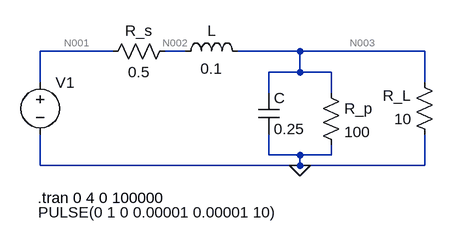
[diagram p0: schematic Draft1.asc]
Draft1.asc, the LTspice schematic file:
Version 4
SHEET 1 880 680
WIRE 0 112 -112 112
WIRE 112 112 80 112
WIRE 288 112 192 112
WIRE 480 112 288 112
WIRE 288 144 288 112
WIRE 288 144 240 144
WIRE 336 144 288 144
WIRE -112 160 -112 112
WIRE 480 160 480 112
WIRE 240 176 240 144
WIRE 336 176 336 144
WIRE 240 272 240 240
WIRE 288 272 240 272
WIRE 336 272 336 256
WIRE 336 272 288 272
WIRE -112 288 -112 240
WIRE 288 288 288 272
WIRE 288 288 -112 288
WIRE 480 288 480 240
WIRE 480 288 288 288
FLAG 288 288 0
SYMBOL res -16 128 R270
WINDOW 0 32 56 VTop 2
WINDOW 3 0 56 VBottom 2
SYMATTR InstName R_s
SYMATTR Value 0.5
SYMBOL ind 96 128 R270
WINDOW 0 32 56 VTop 2
WINDOW 3 5 56 VBottom 2
SYMATTR InstName L
SYMATTR Value 0.1
SYMBOL cap 224 176 R0
SYMATTR InstName C
SYMATTR Value 0.25
SYMBOL res 320 160 R0
SYMATTR InstName R_p
SYMATTR Value 100
SYMBOL res 496 256 R180
WINDOW 0 36 76 Left 2
WINDOW 3 36 40 Left 2
SYMATTR InstName R_L
SYMATTR Value 10
SYMBOL voltage -112 144 R0
WINDOW 3 -3 216 Left 2
WINDOW 123 0 0 Left 0
WINDOW 39 0 0 Left 0
SYMATTR InstName V1
SYMATTR Value PULSE(0 1 0 0.00001 0.00001 10)
TEXT -116 338 Left 2 !.tran 0 4 0 100000

The netlist it stands for:
* Draft1.asc
R_s N001 N002 0.5
L N002 N003 0.1
C N003 0 0.25
R_p N003 0 100
R_L 0 N003 10
V1 N001 0 PULSE(0 1 0 0.00001 0.00001 10)
.tran 0 4 0 100000
.backanno
.end

* Results of the author's LTspice run, read from the files saved beside the schematic
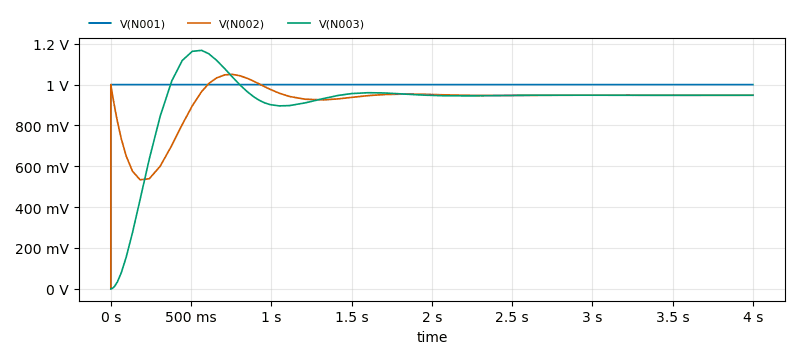
[diagram p1: Transient Analysis of Draft1.asc, plotted from the saved traces]
* Transient Analysis, 1 run:
*   V(N001): min 0 V, max 1 V, average 1 V, rms 1 V, last 1 V
*   V(N002): min 0 V, max 1.05 V, average 920.6 mV, rms 926.6 mV, last 947.9 mV
*   V(N003): min 0 V, max 1.168 V, average 916.3 mV, rms 934.9 mV, last 948 mV